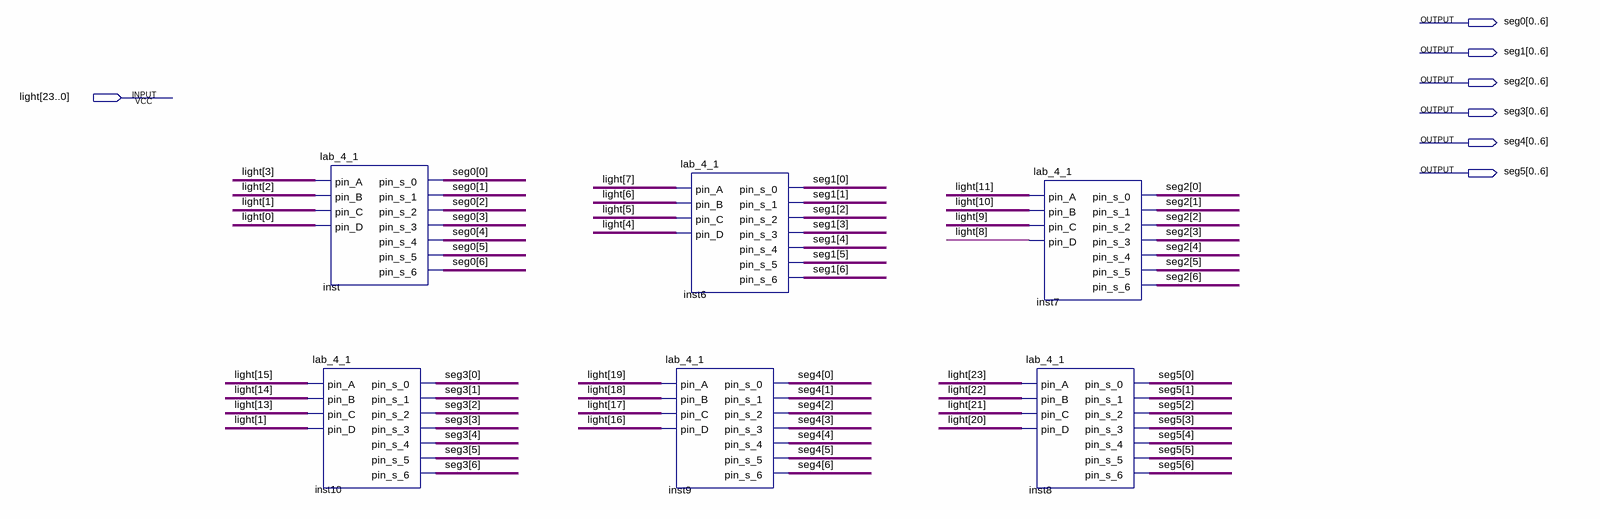
[diagram p0: schematic sheet]
// Quartus schematic lights - Copy.bdf as structural Verilog: 6 symbols, 7 pins
module \lights_-_Copy  (
  input  [23:0] light,
  output [0:6] seg0,
  output [0:6] seg1,
  output [0:6] seg2,
  output [0:6] seg3,
  output [0:6] seg4,
  output [0:6] seg5
);

  lab_4_1 inst (
    .pin_A(light[3]), .pin_B(light[2]), .pin_C(light[1]), .pin_D(light[0]), .pin_s_0(seg0[0]),
    .pin_s_1(seg0[1]), .pin_s_2(seg0[2]), .pin_s_3(seg0[3]), .pin_s_4(seg0[4]), .pin_s_5(seg0[5]),
    .pin_s_6(seg0[6]));
  lab_4_1 inst10 (
    .pin_A(light[15]), .pin_B(light[14]), .pin_C(light[13]), .pin_D(light[1]), .pin_s_0(seg3[0]),
    .pin_s_1(seg3[1]), .pin_s_2(seg3[2]), .pin_s_3(seg3[3]), .pin_s_4(seg3[4]), .pin_s_5(seg3[5]),
    .pin_s_6(seg3[6]));
  lab_4_1 inst6 (
    .pin_A(light[7]), .pin_B(light[6]), .pin_C(light[5]), .pin_D(light[4]), .pin_s_0(seg1[0]),
    .pin_s_1(seg1[1]), .pin_s_2(seg1[2]), .pin_s_3(seg1[3]), .pin_s_4(seg1[4]), .pin_s_5(seg1[5]),
    .pin_s_6(seg1[6]));
  lab_4_1 inst9 (
    .pin_A(light[19]), .pin_B(light[18]), .pin_C(light[17]), .pin_D(light[16]), .pin_s_0(seg4[0]),
    .pin_s_1(seg4[1]), .pin_s_2(seg4[2]), .pin_s_3(seg4[3]), .pin_s_4(seg4[4]), .pin_s_5(seg4[5]),
    .pin_s_6(seg4[6]));
  lab_4_1 inst7 (
    .pin_A(light[11]), .pin_B(light[10]), .pin_C(light[9]), .pin_D(light[8]), .pin_s_0(seg2[0]),
    .pin_s_1(seg2[1]), .pin_s_2(seg2[2]), .pin_s_3(seg2[3]), .pin_s_4(seg2[4]), .pin_s_5(seg2[5]),
    .pin_s_6(seg2[6]));
  lab_4_1 inst8 (
    .pin_A(light[23]), .pin_B(light[22]), .pin_C(light[21]), .pin_D(light[20]), .pin_s_0(seg5[0]),
    .pin_s_1(seg5[1]), .pin_s_2(seg5[2]), .pin_s_3(seg5[3]), .pin_s_4(seg5[4]), .pin_s_5(seg5[5]),
    .pin_s_6(seg5[6]));
endmodule
